# EasyEDA schematic SCH_PressureTempMon_2024-08-19.json
TITLE: Sheet_1; REV: 1.0; Date: 2024-05-02; Sheet: 1/1; Drawn By: cubus; Company: Your Company
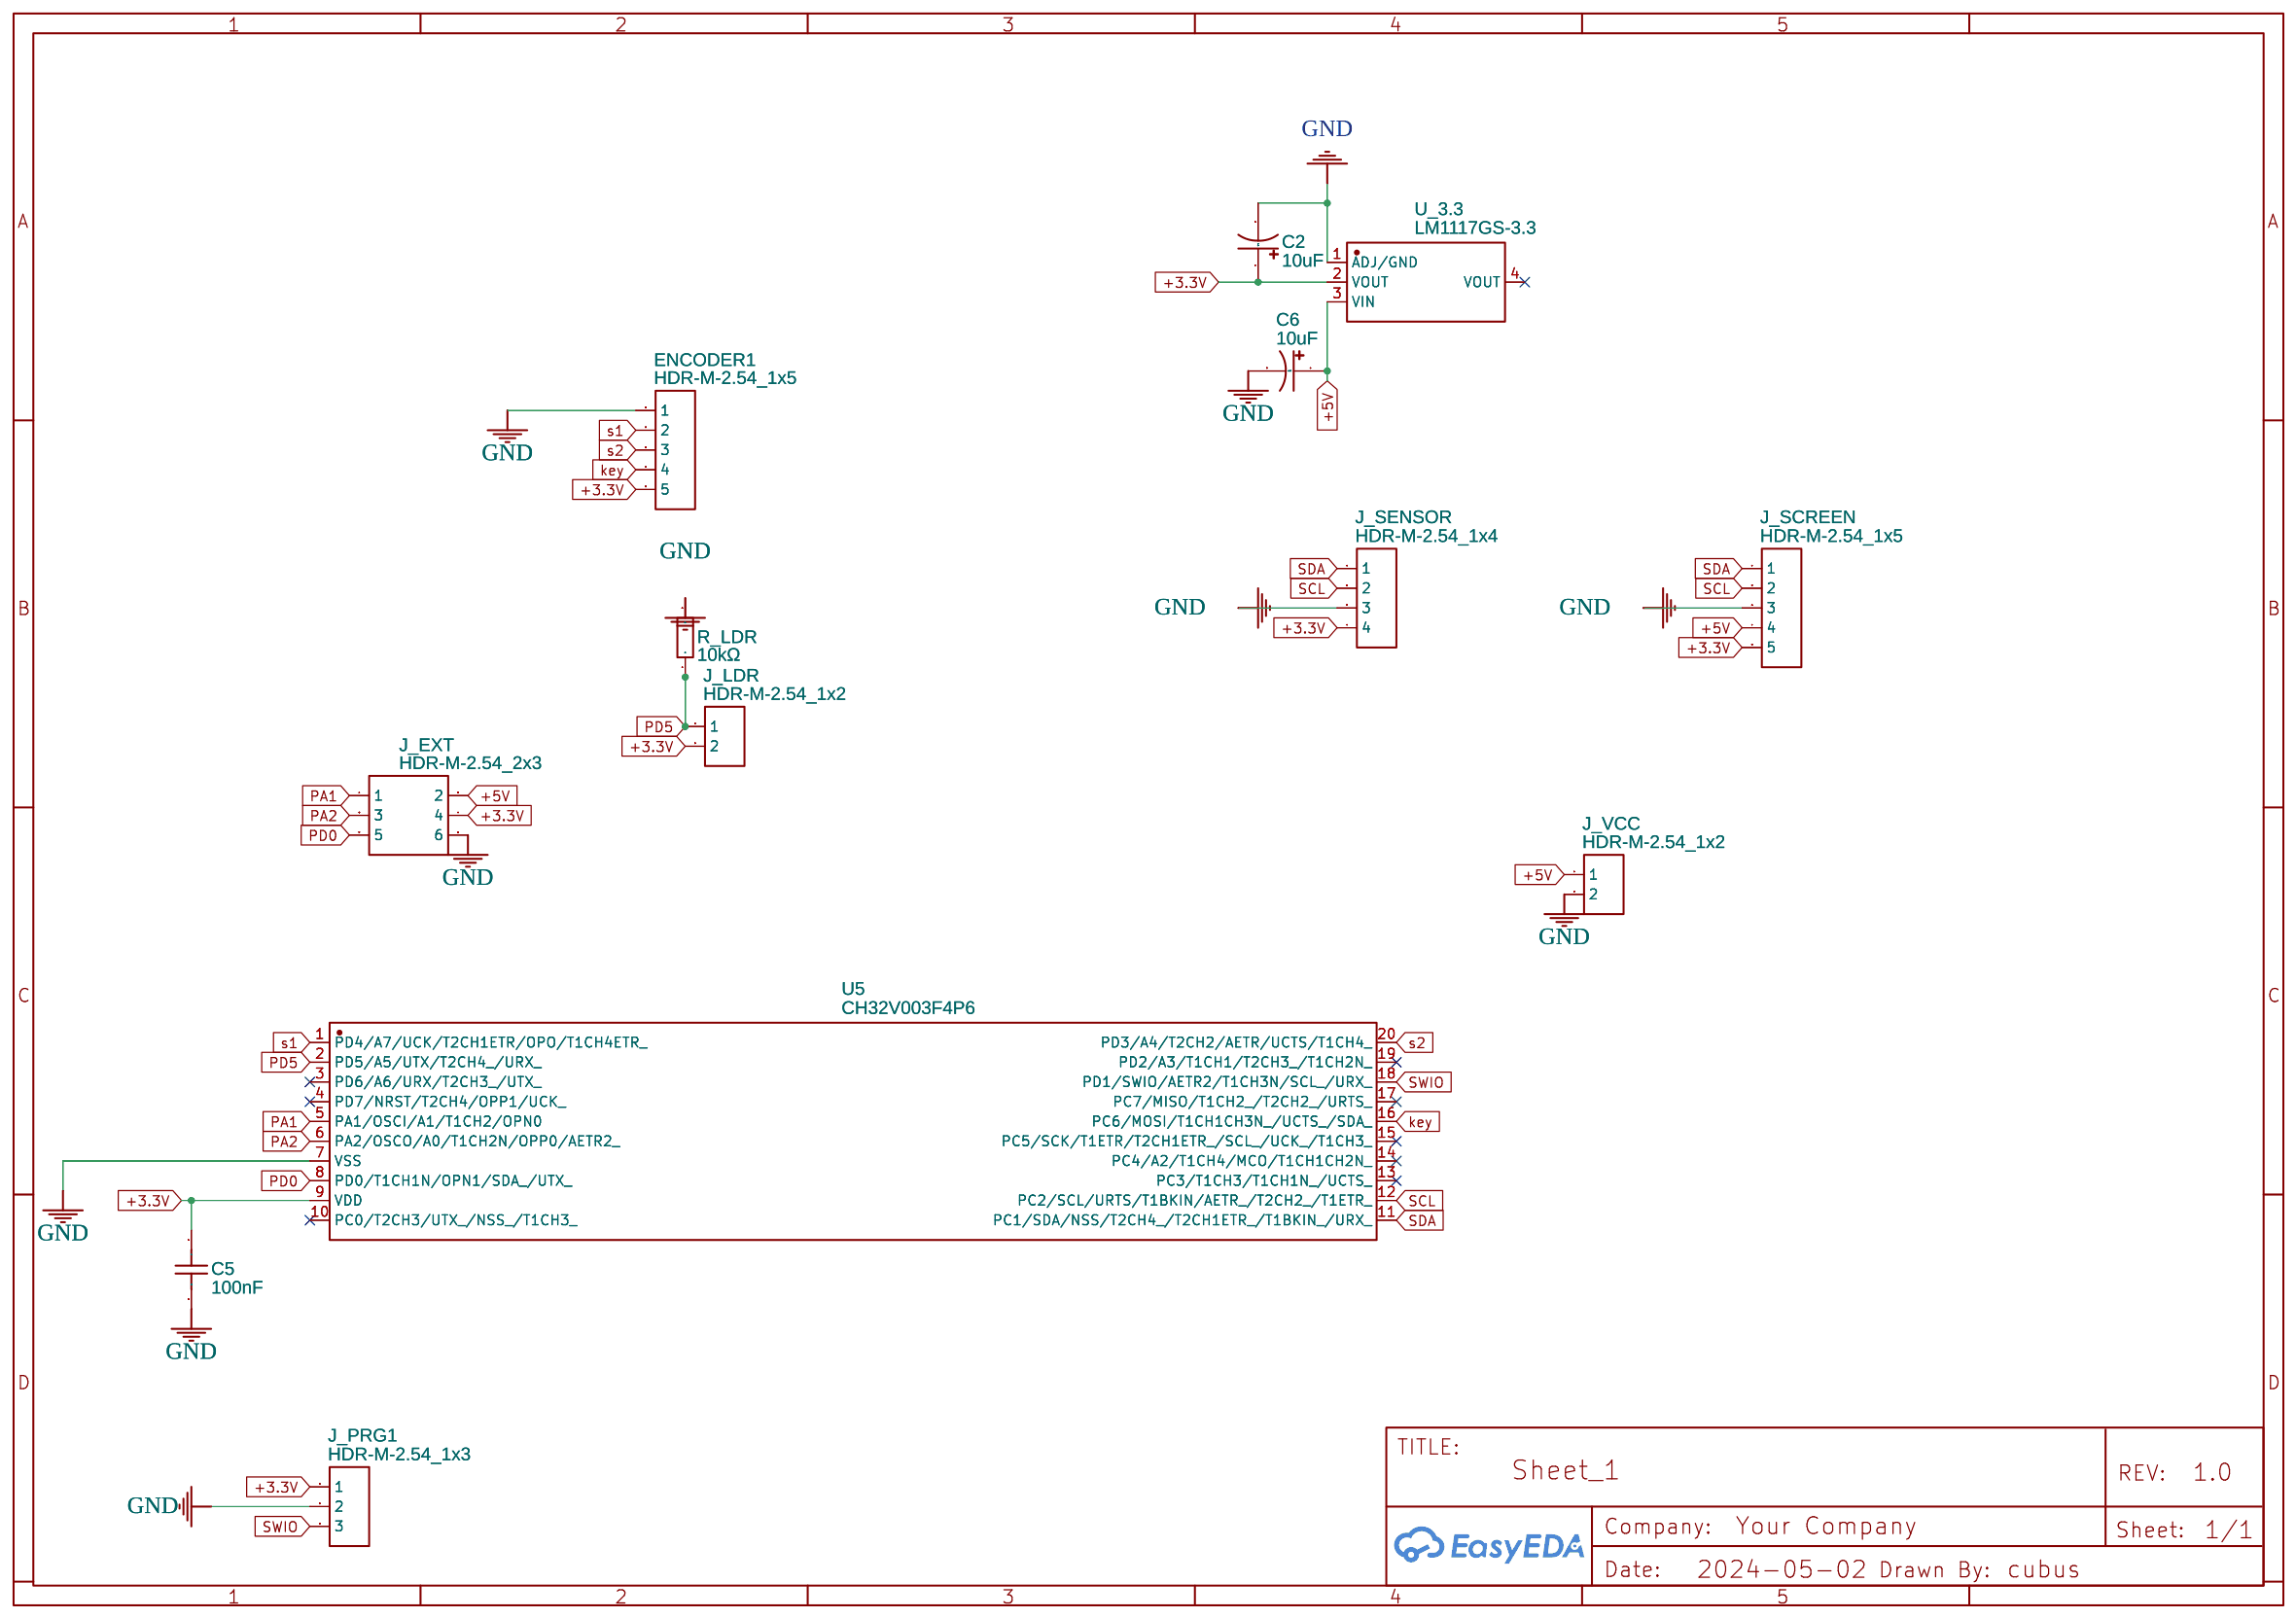
[diagram p0: schematic sheet]

## Parts
C2  10uF  [CASE-A_3216]
C5  100nF  [C1206]
C6  10uF  [CASE-A_3216]
ENCODER1  HDR-M-2.54_1x5  [HDR-M-2.54_1X5]
J_EXT  HDR-M-2.54_2x3  [HDR-M-2.54_2X3]
J_LDR  HDR-M-2.54_1x2  [HDR-M-2.54_1X2]
J_PRG1  HDR-M-2.54_1x3  [HDR-M-2.54_1X3]
J_SCREEN  HDR-M-2.54_1x5  [HDR-M-2.54_1X5]
J_SENSOR  HDR-M-2.54_1x4  [HDR-M-2.54_1X4]
J_VCC  HDR-M-2.54_1x2  [HDR-M-2.54_1X2]
R_LDR  10kΩ  [R0805]
U5  CH32V003F4P6  [TSSOP-20_L6.5-W4.4-P0.65-LS6.4-BL]
U_3  LM1117GS-3.3  [SOT-223-3_L6.5-W3.4-P2.30-LS7.0-BR]  (section 3)

## Library data of the parts
C2 C6 = TCA1A106M8R: Contributor: LCSC; Supplier: LCSC; Supplier Part: C184153; Manufacturer: ROHM(罗姆); JLCPCB Part Class: Extended Part; link: https://lcsc.com/eda_search?q=C184153&%26type=1&ref=editor
C5 = C3216X7R2A104M160AA: Contributor: lcsc; Supplier: LCSC; Supplier Part: C3883507; Manufacturer: TDK; link: https://lcsc.com/eda_search?q=C3883507&%26type=1&ref=editor
ENCODER1 J_SCREEN = HDR-M-2.54_1x5: Supplier Part: C358687; Supplier: LCSC; Contributor: LCEDA_Lib
J_EXT = HDR-M-2.54_2x3: Supplier Part: C65114; Supplier: LCSC; Contributor: LCEDA_Lib
J_LDR J_VCC = HDR-M-2.54_1x2: Supplier Part: C124375; Supplier: LCSC; Contributor: LCEDA_Lib
J_PRG1 = HDR-M-2.54_1x3: Supplier Part: C180248; Supplier: LCSC; Contributor: LCEDA_Lib
J_SENSOR = HDR-M-2.54_1x4: Supplier Part: C124378; Supplier: LCSC; Contributor: LCEDA_Lib
R_LDR = HPCR0805F560RK9: Contributor: LCSC; Supplier: LCSC; Supplier Part: C365324; Manufacturer: RESI(开步睿思）; JLCPCB Part Class: Extended Part
U5 = CH32V003F4P6: Contributor: lcsc; Supplier: LCSC; Supplier Part: C5187096; Manufacturer: null; JLCPCB Part Class: Extended Part; link: https://lcsc.com/eda_search?q=C5187096&%26type=1&ref=editor
U_3 = LM1117GS-3.3: Contributor: LCSC; Supplier: LCSC; Supplier Part: C411821; Manufacturer: HTC; JLCPCB Part Class: Extended Part; link: https://lcsc.com/eda_search?q=C411821&%26type=1&ref=editor

## Nets
+3.3V: C2.1 C5.1 ENCODER1.5 J_EXT.4 J_LDR.2 J_PRG1.1 J_SCREEN.5 J_SENSOR.4 U5.9(VDD) U_3.2(VOUT)
+5V: C6.1 J_EXT.2 J_SCREEN.4 J_VCC.1 U_3.3(VIN)
GND: C2.2 C5.2 C6.2 ENCODER1.1 J_EXT.6 J_PRG1.2 J_SCREEN.3 J_SENSOR.3 J_VCC.2 R_LDR.2 U5.7(VSS) U_3.1(ADJ/GND)
key: ENCODER1.4 U5.16(PC6/MOSI/T1CH1CH3N_/UCTS_/SDA_)
PA1: J_EXT.1 U5.5(PA1/OSCI/A1/T1CH2/OPN0)
PA2: J_EXT.3 U5.6(PA2/OSCO/A0/T1CH2N/OPP0/AETR2_)
PD0: J_EXT.5 U5.8(PD0/T1CH1N/OPN1/SDA_/UTX_)
PD5: J_LDR.1 R_LDR.1 U5.2(PD5/A5/UTX/T2CH4_/URX_)
s1: ENCODER1.2 U5.1(PD4/A7/UCK/T2CH1ETR/OPO/T1CH4ETR_)
s2: ENCODER1.3 U5.20(PD3/A4/T2CH2/AETR/UCTS/T1CH4_)
SCL: J_SCREEN.2 J_SENSOR.2 U5.12(PC2/SCL/URTS/T1BKIN/AETR_/T2CH2_/T1ETR_)
SDA: J_SCREEN.1 J_SENSOR.1 U5.11(PC1/SDA/NSS/T2CH4_/T2CH1ETR_/T1BKIN_/URX_)
SWIO: J_PRG1.3 U5.18(PD1/SWIO/AETR2/T1CH3N/SCL_/URX_)

Not connected (* = marked no-connect by the designer): U5 3(PD6/A6/URX/T2CH3_/UTX_)* 4(PD7/NRST/T2CH4/OPP1/UCK_)* 10(PC0/T2CH3/UTX_/NSS_/T1CH3_)* 13(PC3/T1CH3/T1CH1N_/UCTS_)* 14(PC4/A2/T1CH4/MCO/T1CH1CH2N_)* 15(PC5/SCK/T1ETR/T2CH1ETR_/SCL_/UCK_/T1CH3_)* 17(PC7/MISO/T1CH2_/T2CH2_/URTS_)* 19(PD2/A3/T1CH1/T2CH3_/T1CH2N_)*; U_3 4(VOUT)*
